# EAGLE design placa_1.0 (EAGLE 7.2.0)
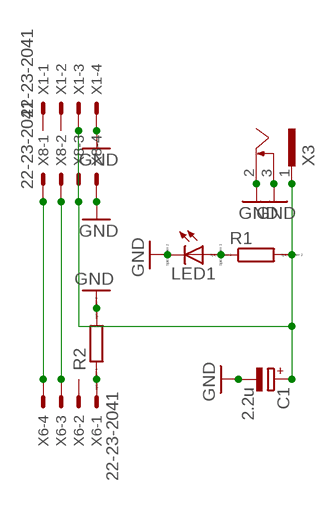
[diagram p0: schematic, sheet 1]

## Parts
C1  2.2u  CPOL-EUE5-13  [E5-13]
LED1  LED_ELD260  [LED_LD260]
R1  R0207/10  [0207/10]
R2  R0207/10  [0207/10]
X1  22-23-2041  [22-23-2041]
X3  SCD-014A  [SCD-014-A]
X6  22-23-2041  [22-23-2041]
X8  22-23-2041  [22-23-2041]

## Nets
GND: C1.- LED1.K(C) R2.2 X1.4 X3.2 X3.3 X8.4
N$2: R2.1 X6.1
N$4: X6.4 X8.1
N$5: X6.3 X8.2
N$7: LED1.A R1.1
VCC: C1.+ R1.2 X1.3 X3.1 X8.3
Unconnected: X1.1 X1.2 X6.2

## Library data of the parts
C1 = rcl:CPOL-EU: POLARIZED CAPACITOR, European symbol
LED1 = eagle-ltspice:LED_E: LED Source: http://www.osram.convergy.de Source: www.luxeon.com Source: www.kingbright.com; SPICEMODEL: NONE; SPICEPREFIX: D; SPICETYPE: diode
R1 R2 = eagle-ltspice:R: RESISTOR, European symbol; SPICEMODEL: NONE; SPICEPREFIX: R
X1 X6 X8 = con-molex:22-23-2041: .100" (2.54mm) Center Header - 4 Pin; MF: MOLEX; MPN: 22-23-2041; OC_FARNELL: 1462920; OC_NEWARK: 38C0355
X3 = PowerJack:SCD-014A: Power Jack 2.5mm; OC_FARNELL: unknown; OC_NEWARK: unknown

## Board
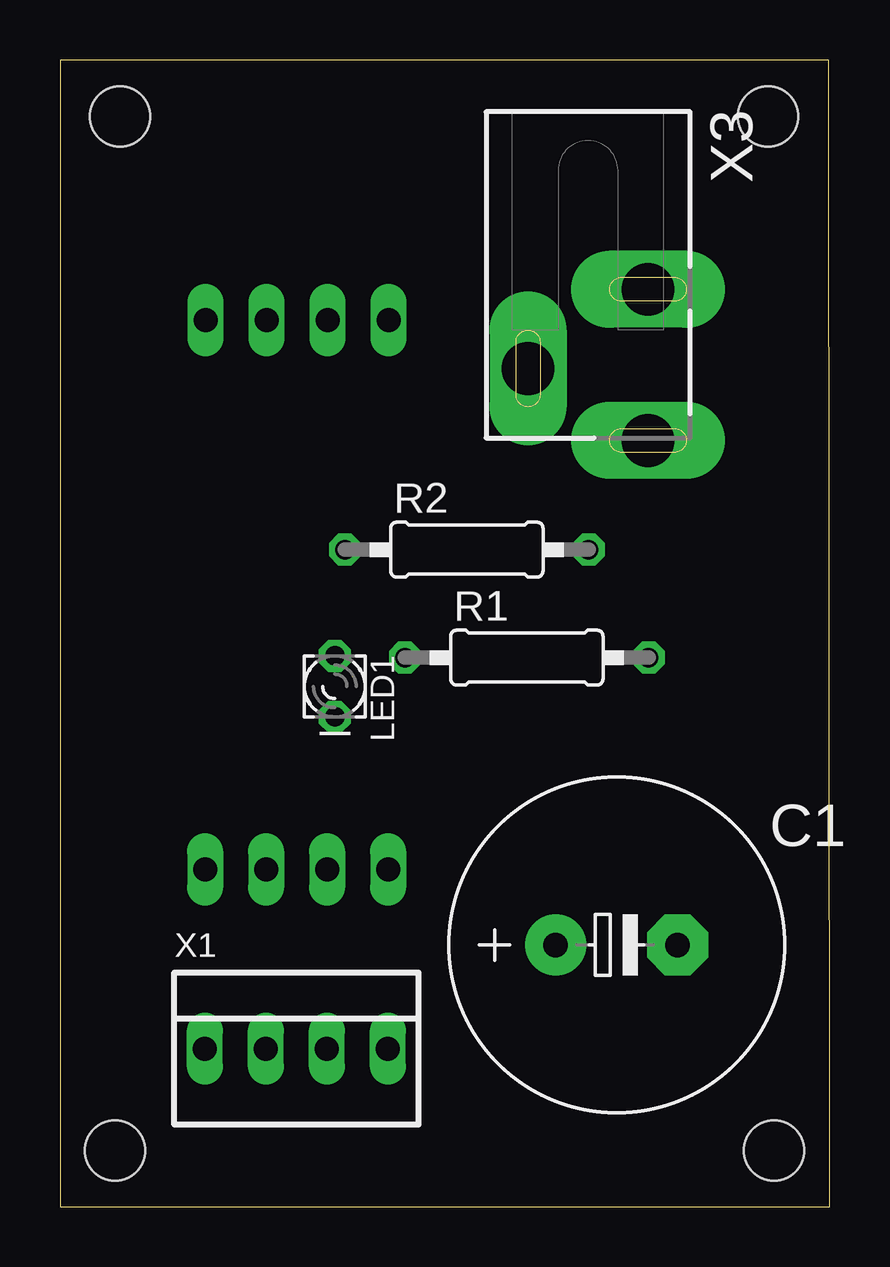
[diagram p1: board, top side]
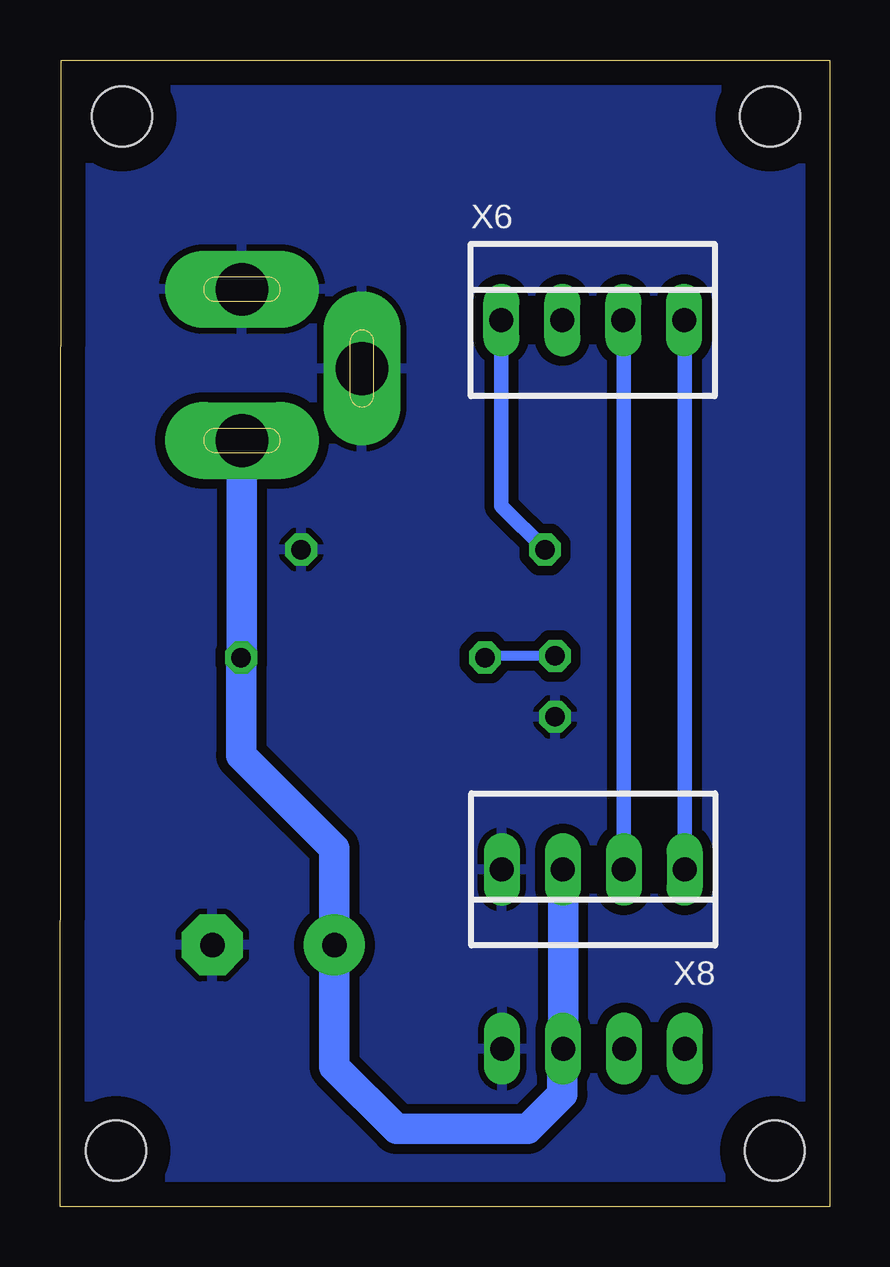
[diagram p2: board, bottom side, seen from below]

Size 32.08 x 47.81 mm. Coordinates in mm from the lower left corner, seen from the top.
Outline: 0,0 32.08,0 32.03,47.81 0,47.81 0,0
Copper layers (1*16): Top 0.035mm / dielectric 1.5mm / Bottom 0.035mm
Design rules "default *": minimum track width 10mil, minimum drill 24mil, track to track 16mil, track to pad 16mil, pad to pad 16mil, via to via 16mil, smd to smd 16mil, copper to edge 40mil, drill to drill 8mil, minimum pad ring 10mil, minimum via ring 8mil, stop-mask expansion 4mil, vias tented up to drill 0mil, thermal gap 10mil
Holes 2.5 mm at 2.3,2.35 29.75,2.35 29.5,45.45 2.5,45.45

### Footprints (pad centres in the part's own frame; a part is rotated, then mirrored left to right if it is on the bottom)
E5-13 = drill 1.016 pad 2.54: + -2.54,0 | drill 1.016 pad 2.54 octagon: - 2.54,0
LED_LD260 = drill 0.813 octagon: A -1.27,0; K 1.27,0
0207/10 = drill 0.813 octagon: 1 -5.08,0; 2 5.08,0
22-23-2041 = drill 1 long: 1 -3.81,0; 2 -1.27,0; 3 1.27,0; 4 3.81,0
SCD-014-A = drill 2.2 pad 2.5 long: 1 -2.5,13.8; 2 -2.5,7.5; 3 2.5,10.8

### Placement (x,y rotation side)
C1  23.19,10.92 0 top
LED1  11.45,21.7 270 top
R1  19.45,22.9 0 top
R2  16.95,27.4 0 top
X1  9.85,6.6 0 top
X3  22,45.75 180 top
X6  9.88,36.97 0 bottom
X8  9.86,14.07 180 bottom

### Tracks (layer width: path | path; a pad name or v marks a point on that pad's centre or on a via)
GND
  pour Bottom: 1.95,47.05 31.3,46.9 31.3,46.75 31.55,46.75 31.55,0.9 1.1,0.85 0.85,0.85 0.85,0.9 1.25,47.05
N$2
  Bottom 0.61: X6.1 13.69,29.22 R2.1
N$4
  Bottom 0.61: X6.4 6.05,36.95 X8.1
N$5
  Bottom 0.61: X6.3 8.59,36.95 X8.2
N$7
  Bottom 0.406: LED1.A 14.37,22.97 R1.1
VCC
  Bottom 1.27: X3.1 24.5,22.93 R1.2 24.53,18.83 20.65,14.95 C1.+ 20.65,5.85 18.05,3.25 12.6,3.25 11.15,4.7 11.15,6.57 X1.3 X8.3